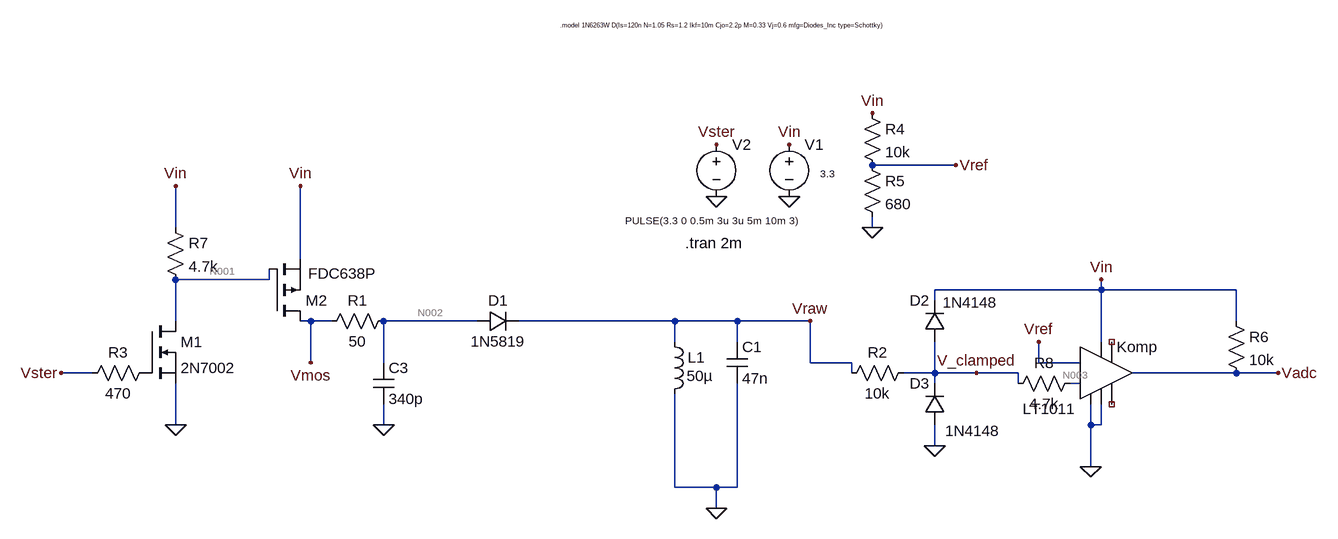
[diagram p0: schematic Pomiar_L.asc]
Pomiar_L.asc, the LTspice schematic file:
Version 4.1
SHEET 1 2120 680
WIRE 880 -144 752 -144
WIRE -320 -48 -320 -112
WIRE 752 -48 752 -64
WIRE -128 0 -128 -112
WIRE -176 32 -176 16
WIRE -176 32 -320 32
WIRE 1104 48 1104 32
WIRE 1104 48 848 48
WIRE 1312 48 1104 48
WIRE 848 64 848 48
WIRE -320 96 -320 32
WIRE -112 96 -128 96
WIRE -80 96 -112 96
WIRE 144 96 0 96
WIRE 448 96 208 96
WIRE 544 96 448 96
WIRE 656 96 544 96
WIRE 1312 96 1312 48
WIRE 448 128 448 96
WIRE 544 128 544 96
WIRE 1104 128 1104 48
WIRE -112 160 -112 96
WIRE 0 160 0 96
WIRE 656 160 656 96
WIRE 720 160 656 160
WIRE 1008 160 1008 128
WIRE 1072 160 1008 160
WIRE -448 176 -496 176
WIRE 720 176 720 160
WIRE 848 176 848 128
WIRE 848 176 800 176
WIRE 912 176 848 176
WIRE 976 176 912 176
WIRE 1312 176 1152 176
WIRE 1376 176 1312 176
WIRE 848 192 848 176
WIRE 976 192 976 176
WIRE 1072 192 1056 192
WIRE -320 256 -320 192
WIRE 0 256 0 224
WIRE 1088 256 1088 224
WIRE 1104 256 1104 224
WIRE 1104 256 1088 256
WIRE 848 288 848 256
WIRE 1088 320 1088 256
WIRE 448 352 448 208
WIRE 512 352 448 352
WIRE 544 352 544 192
WIRE 544 352 512 352
WIRE 512 384 512 352
FLAG 624 -96 0
FLAG 512 384 0
FLAG 512 -96 0
FLAG 512 -176 Vster
FLAG -496 176 Vster
FLAG -320 -112 Vin
FLAG 624 -176 Vin
FLAG 752 -48 0
FLAG 752 -224 Vin
FLAG 880 -144 Vref
FLAG 1008 128 Vref
FLAG 1088 320 0
FLAG 1104 32 Vin
FLAG 1376 176 Vadc
FLAG 656 96 Vraw
FLAG -320 256 0
FLAG -128 -112 Vin
FLAG -112 160 Vmos
FLAG 0 256 0
FLAG 848 288 0
FLAG 912 176 V_clamped
SYMBOL ind 432 112 R0
WINDOW 3 34 68 Left 2
SYMATTR Value 50µ
SYMATTR InstName L1
SYMATTR SpiceLine Ipk=0.26 Rser=0.86 Rpar=26100 Cpar=0 mfg="Bourns, Inc." pn="SRR4028-151Y"
SYMBOL cap 528 128 R0
SYMATTR InstName C1
SYMATTR Value 47n
SYMATTR SpiceLine V=250 Irms=0 Rser=0.0086 Lser=1.1n mfg="Würth Elektronik" pn="885342214002 WCAP-CSMH 2220" type="X7R"
SYMBOL voltage 624 -192 R0
WINDOW 3 48 61 Left 1
WINDOW 123 0 0 Left 0
WINDOW 39 0 0 Left 0
SYMATTR Value 3.3
SYMATTR InstName V1
SYMBOL nmos -368 96 R0
SYMATTR InstName M1
SYMATTR Value 2N7002
SYMBOL Comparators\\LT1011 1104 176 R0
WINDOW 3 -121 55 Left 2
SYMATTR InstName Komp
SYMBOL voltage 512 -192 R0
WINDOW 3 -140 133 Left 1
WINDOW 123 0 0 Left 0
WINDOW 39 0 0 Left 0
SYMATTR Value PULSE(3.3 0 0.5m 3u 3u 5m 10m 3)
SYMATTR InstName V2
SYMBOL res 736 -240 R0
SYMATTR InstName R4
SYMATTR Value 10k
SYMBOL res 736 -160 R0
SYMATTR InstName R5
SYMATTR Value 680
SYMBOL res 1296 80 R0
SYMATTR InstName R6
SYMATTR Value 10k
SYMBOL pmos -176 96 M180
WINDOW 3 60 73 Left 2
SYMATTR Value FDC638P
SYMATTR InstName M2
SYMBOL res -336 -64 R0
SYMATTR InstName R7
SYMATTR Value 4.7k
SYMBOL res 16 80 R90
WINDOW 0 0 56 VBottom 2
WINDOW 3 32 56 VTop 2
SYMATTR InstName R1
SYMATTR Value 50
SYMBOL diode 144 112 R270
WINDOW 0 32 32 VTop 2
WINDOW 3 0 32 VBottom 2
SYMATTR InstName D1
SYMATTR Value 1N5819
SYMBOL cap -16 160 R0
SYMATTR InstName C3
SYMATTR Value 340p
SYMATTR SpiceLine V=100 Irms=10m Rser=43 Lser=0 mfg="Nichicon" pn="UPR2AR47MAH" type="Al electrolytic"
SYMBOL diode 864 256 R180
WINDOW 0 24 64 Left 2
WINDOW 3 -85 -9 Left 2
SYMATTR InstName D3
SYMATTR Value 1N4148
SYMBOL res 816 160 R90
WINDOW 0 0 56 VBottom 2
WINDOW 3 32 56 VTop 2
SYMATTR InstName R2
SYMATTR Value 10k
SYMBOL diode 864 128 R180
WINDOW 0 24 64 Left 2
WINDOW 3 -81 61 Left 2
SYMATTR InstName D2
SYMATTR Value 1N4148
SYMBOL res -352 160 R90
WINDOW 0 0 56 VBottom 2
WINDOW 3 32 56 VTop 2
SYMATTR InstName R3
SYMATTR Value 470
SYMBOL res 1072 176 R90
WINDOW 0 0 56 VBottom 2
WINDOW 3 32 56 VTop 2
SYMATTR InstName R8
SYMATTR Value 4.7k
TEXT 464 -24 Left 2 !.tran 2m
TEXT 272 -360 Left 0 !.model 1N6263W D(Is=120n N=1.05 Rs=1.2 Ikf=10m Cjo=2.2p M=0.33 Vj=0.6 mfg=Diodes_Inc type=Schottky)

The netlist it stands for:
* Pomiar_L.asc
L1 Vraw 0 50µ Ipk=0.26 Rser=0.86 Rpar=26100 Cpar=0 mfg="Bourns, Inc." pn="SRR4028-151Y"
C1 Vraw 0 47n V=250 Irms=0 Rser=0.0086 Lser=1.1n mfg="Würth Elektronik" pn="885342214002 WCAP-CSMH 2220" type="X7R"
V1 Vin 0 3.3
M1 N001 P001 0 0 2N7002
X§Komp 0 N003 Vref 0 NC_01 NC_02 Vadc Vin LT1011
V2 Vster 0 PULSE(3.3 0 0.5m 3u 3u 5m 10m 3)
R4 Vin Vref 10k
R5 Vref 0 680
R6 Vin Vadc 10k
M2 Vmos N001 Vin Vin FDC638P
R7 Vin N001 4.7k
R1 N002 Vmos 50
D1 N002 Vraw 1N5819
C3 N002 0 340p V=100 Irms=10m Rser=43 Lser=0 mfg="Nichicon" pn="UPR2AR47MAH" type="Al electrolytic"
D3 0 V_clamped 1N4148
R2 V_clamped Vraw 10k
D2 V_clamped Vin 1N4148
R3 P001 Vster 470
R8 N003 V_clamped 4.7k
.model D D
.lib standard.dio
.model NMOS NMOS
.model PMOS PMOS
.lib standard.mos
.tran 2m
.model 1N6263W D(Is=120n N=1.05 Rs=1.2 Ikf=10m Cjo=2.2p M=0.33 Vj=0.6 mfg=Diodes_Inc type=Schottky)
.lib LTC1.lib
.backanno
.end

* Results of the author's LTspice run, read from the files saved beside the schematic
* Operating Point, zero values left out:
*   V(vin) = 3.3 V
*   V(p001) = 3.3 V
*   V(n003) = 51.5 mV
*   V(vster) = 3.3 V
*   V(n002) = 321.9 mV
*   V(v_clamped) = 51.4 mV
*   V(vraw) = 51.17 mV
*   V(n001) = 2.47 mV
*   V(vref) = 210.1 mV
*   V(vadc) = 153.7 mV
*   V(vmos) = 3.297 V
*   I(V1) = -64.03 mA
*   I(R5) = 309 µA
*   I(R7) = 701.6 µA
*   I(R2) = 22.23 nA
*   I(R8) = 21.41 nA
*   I(L1) = 59.51 mA
*   I(D1) = 59.51 mA
*   Id(M1) = 701.6 µA
*   Is(M1) = -701.6 µA
*   I(R4) = 309 µA
*   I(R6) = 314.6 µA
*   I(D3) = -1.709 nA
*   Id(M2) = -59.51 mA
*   Is(M2) = 59.51 mA
*   I(R1) = -59.51 mA
*   I(D2) = -2.523 nA
*   Ix(komp:1) = -1.815 mA
*   Ix(komp:2) = -21.41 nA
*   Ix(komp:3) = -21.29 nA
*   Ix(komp:4) = -1.699 mA
*   Ix(komp:7) = 314.6 µA
*   Ix(komp:8) = 3.199 mA
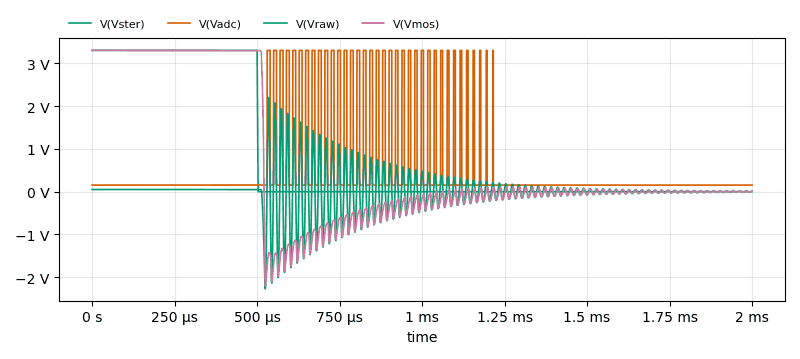
[diagram p1: Transient Analysis of Pomiar_L.asc, plotted from the saved traces]
* Transient Analysis, 1 run:
*   V(Vster): min 0 V, max 3.3 V, average 827.5 mV, rms 1.652 V, last 0 V
*   V(Vadc): min 152.6 mV, max 3.3 V, average 567.1 mV, rms 1.202 V, last 153.7 mV
*   V(Vraw): min -2.268 V, max 2.198 V, average 7.323 mV, rms 456.9 mV, last 11.07 mV
*   V(Vmos): min -2.206 V, max 3.297 V, average 632.7 mV, rms 1.744 V, last 7.321 mV